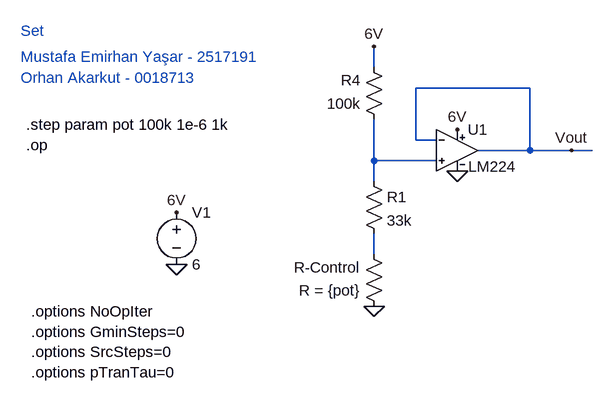
[diagram p0: schematic Unit_Set.asc]
Unit_Set.asc, the LTspice schematic file:
Version 4
SHEET 1 880 680
WIRE 64 16 64 -16
WIRE 304 48 128 48
WIRE 128 128 128 48
WIRE 160 128 128 128
WIRE 304 144 304 48
WIRE 304 144 224 144
WIRE 368 144 304 144
WIRE 400 144 368 144
WIRE 64 160 64 96
WIRE 160 160 64 160
WIRE 64 192 64 160
WIRE 64 304 64 272
FLAG -240 320 0
FLAG -240 240 6V
FLAG 64 -16 6V
FLAG 64 384 0
FLAG 368 144 Vout
FLAG 192 112 6V
FLAG 192 176 0
SYMBOL OpAmps\\LM224 192 80 R0
SYMATTR InstName U1
SYMBOL res 80 112 R180
WINDOW 0 36 76 Left 2
WINDOW 3 36 40 Left 2
SYMATTR InstName R4
SYMATTR Value 100k
SYMBOL res 80 400 R180
WINDOW 0 36 76 Left 2
WINDOW 3 36 40 Left 2
SYMATTR InstName R-Control
SYMATTR Value R = {pot}
SYMBOL voltage -240 224 R0
WINDOW 123 0 0 Left 0
WINDOW 39 0 0 Left 0
SYMATTR InstName V1
SYMATTR Value 6
SYMBOL res 48 176 R0
SYMATTR InstName R1
SYMATTR Value 33k
TEXT -480 -40 Left 2 ;Set
TEXT -480 0 Left 2 ;Mustafa Emirhan Yaşar - 2517191
TEXT -480 32 Left 2 ;Orhan Akarkut - 0018713
TEXT -472 104 Left 2 !.step param pot 100k 1e-6 1k
TEXT -472 136 Left 2 !.op
TEXT -464 392 Left 2 !.options NoOpIter\n.options GminSteps=0\n.options SrcSteps=0\n.options pTranTau=0

The netlist it stands for:
* Unit_Set.asc
XU1 N001 Vout 6V 0 Vout LM224  ; pins In+ In- V+ V- OUT
R4 N001 6V 100k
R-Control 0 N002 R = {pot}
V1 6V 0 6
R1 N001 N002 33k
* Set
* Mustafa Emirhan Yaşar - 2517191
* Orhan Akarkut - 0018713
.step param pot 100k 1e-6 1k
.op
.options NoOpIter
.options GminSteps=0
.options SrcSteps=0
.options pTranTau=0
.lib LM224.lib
.backanno
.end